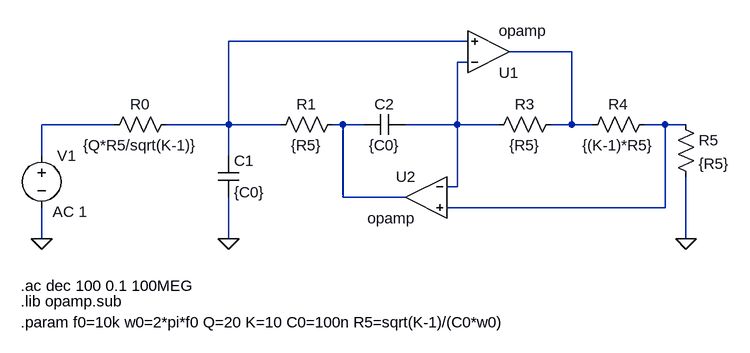
[diagram p0: schematic TS2.asc]
TS2.asc, the LTspice schematic file:
Version 4
SHEET 1 880 680
WIRE 336 16 -32 16
WIRE 496 32 400 32
WIRE 336 48 320 48
WIRE -208 144 -320 144
WIRE -32 144 -32 16
WIRE -32 144 -128 144
WIRE 48 144 -32 144
WIRE 144 144 128 144
WIRE 176 144 144 144
WIRE 320 144 320 48
WIRE 320 144 240 144
WIRE 384 144 320 144
WIRE 496 144 496 32
WIRE 496 144 464 144
WIRE 528 144 496 144
WIRE 640 144 608 144
WIRE 672 144 640 144
WIRE -320 192 -320 144
WIRE -32 192 -32 144
WIRE 320 240 320 144
WIRE 320 240 304 240
WIRE 144 256 144 144
WIRE 240 256 144 256
WIRE 640 272 640 144
WIRE 640 272 304 272
WIRE -320 320 -320 272
WIRE -32 320 -32 256
WIRE 672 320 672 224
FLAG -320 320 0
FLAG -32 320 0
FLAG 672 320 0
SYMBOL OpAmps\\opamp 368 96 M180
SYMATTR InstName U1
SYMBOL voltage -320 176 R0
WINDOW 123 17 102 Left 2
WINDOW 39 0 0 Left 0
SYMATTR Value2 AC 1
SYMATTR InstName V1
SYMATTR Value ""
SYMBOL res -112 128 R90
WINDOW 0 0 56 VBottom 2
WINDOW 3 32 56 VTop 2
SYMATTR InstName R0
SYMATTR Value {Q*R5/sqrt(K-1)}
SYMBOL cap -48 192 R0
SYMATTR InstName C1
SYMATTR Value {C0}
SYMBOL OpAmps\\opamp 272 192 M0
SYMATTR InstName U2
SYMBOL res 144 128 R90
WINDOW 0 0 56 VBottom 2
WINDOW 3 32 56 VTop 2
SYMATTR InstName R1
SYMATTR Value {R5}
SYMBOL cap 240 128 R90
WINDOW 0 0 32 VBottom 2
WINDOW 3 32 32 VTop 2
SYMATTR InstName C2
SYMATTR Value {C0}
SYMBOL res 480 128 R90
WINDOW 0 0 56 VBottom 2
WINDOW 3 32 56 VTop 2
SYMATTR InstName R3
SYMATTR Value {R5}
SYMBOL res 624 128 R90
WINDOW 0 0 56 VBottom 2
WINDOW 3 32 56 VTop 2
SYMATTR InstName R4
SYMATTR Value {(K-1)*R5}
SYMBOL res 656 128 R0
SYMATTR InstName R5
SYMATTR Value {R5}
TEXT -352 392 Left 2 !.ac dec 100 0.1 100MEG
TEXT -352 416 Left 2 !.lib opamp.sub
TEXT -352 448 Left 2 !.param f0=10k w0=2*pi*f0 Q=20 K=10 C0=100n R5=sqrt(K-1)/(C0*w0)

The netlist it stands for:
* TS2.asc
XU1 N003 N001 N002 opamp Aol=100K GBW=10Meg  ; pins invin noninvin out
V1 N004 0 AC 1
R0 N001 N004 {Q*R5/sqrt(K-1)}
C1 N001 0 {C0}
XU2 N003 N006 N005 opamp Aol=100K GBW=10Meg  ; pins invin noninvin out
R1 N005 N001 {R5}
C2 N003 N005 {C0}
R3 N002 N003 {R5}
R4 N006 N002 {(K-1)*R5}
R5 N006 0 {R5}
.ac dec 100 0.1 100MEG
.lib opamp.sub
.param f0=10k w0=2*pi*f0 Q=20 K=10 C0=100n R5=sqrt(K-1)/(C0*w0)
.backanno
.end